# Altium project forwardConverterPCB.PrjPcb (part 1 of 22)
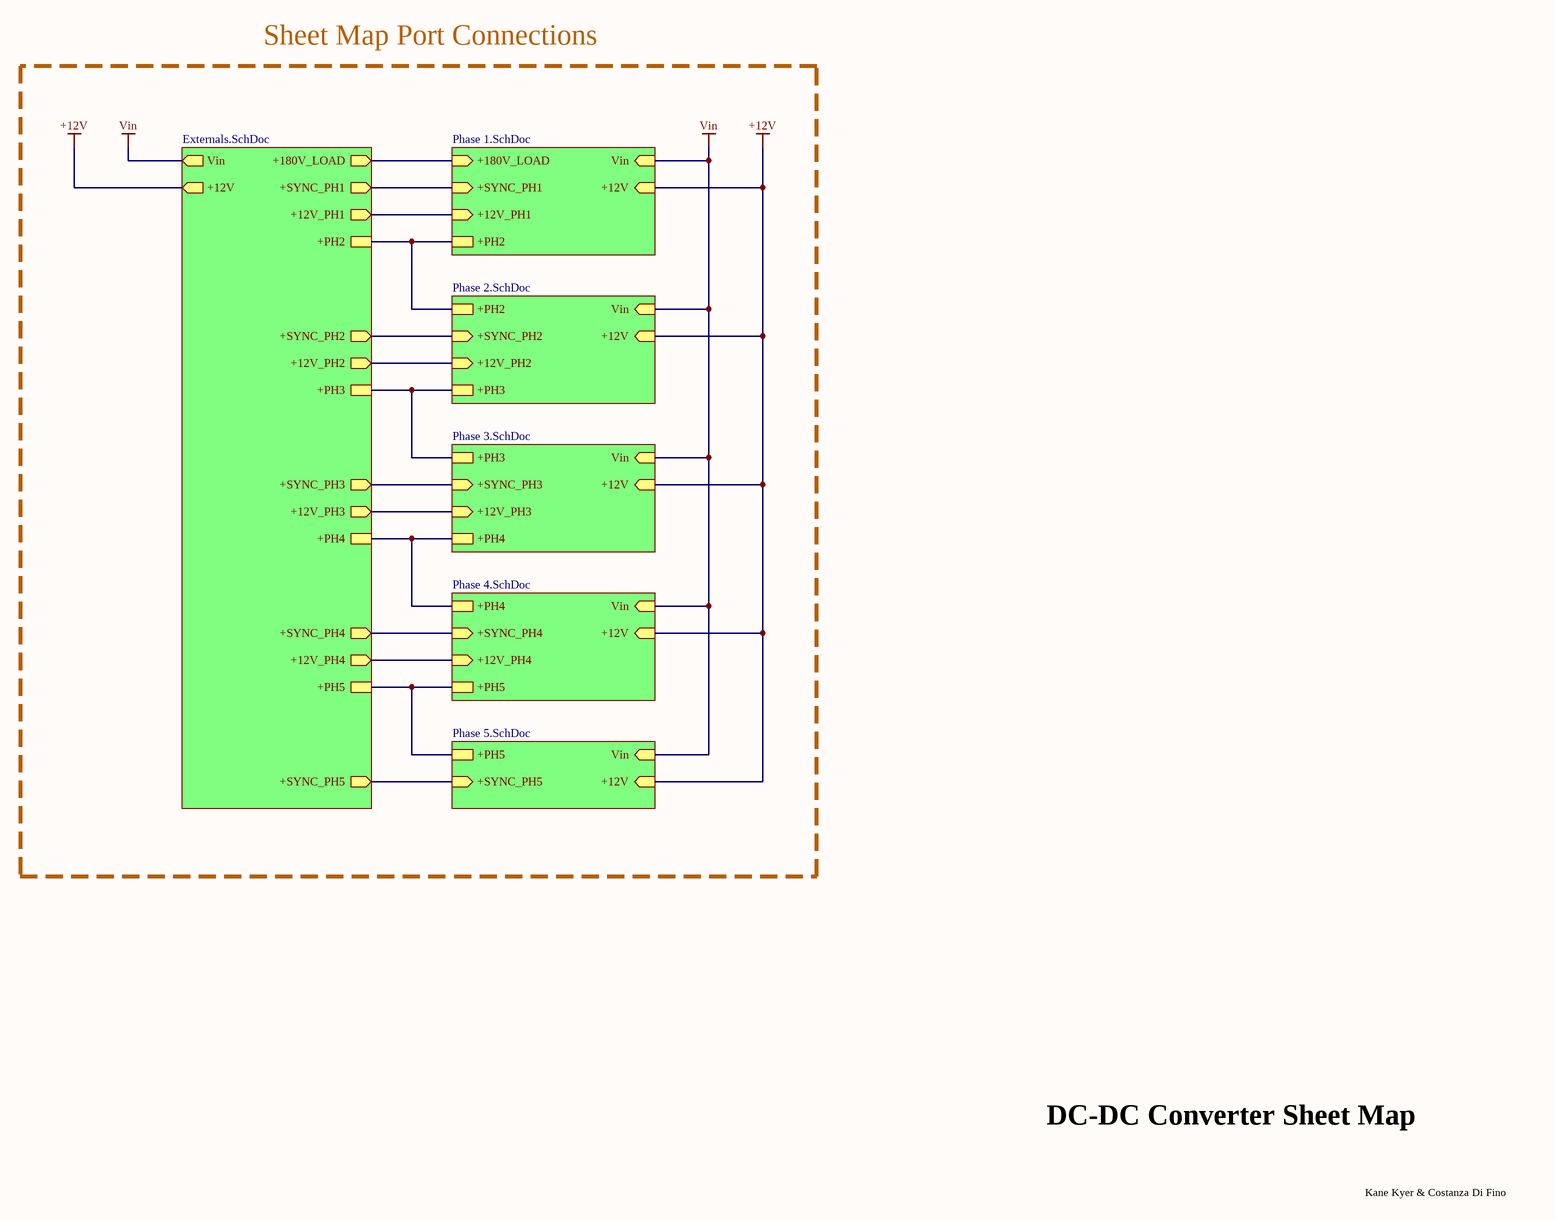
[diagram p0: SHEET_MAP.SchDoc]
7 sheets, 352 parts. Net scope: hierarchical (ports join the sheet entries above them; power ports are global).
Board file: forwardConverterPCB.PcbDoc
Sheets:
  SHEET_MAP.SchDoc
    U_EXTERNAL = Externals.SchDoc
    U_LTC3751_PH1 = Phase 1.SchDoc
    U_LTC3751_PH2 = Phase 2.SchDoc
    U_LTC3751_PH3 = Phase 3.SchDoc
    U_LTC3751_PH4 = Phase 4.SchDoc
    U_LTC3751_PH5 = Phase 5.SchDoc

## Sheet SHEET_MAP.SchDoc
size Tabloid; SheetNumber: 1; SheetTotal: 7

### Sub-sheets
U_EXTERNAL = Externals.SchDoc: +SYNC_PH1 (out), +SYNC_PH2 (out), +SYNC_PH3 (out), +SYNC_PH4 (out), +SYNC_PH5 (out), +180V_LOAD (out), Vin (out), +12V (out), +12V_PH1 (out), +12V_PH2 (out), +12V_PH3 (out), +12V_PH4 (out), +PH2, +PH3, +PH4, +PH5
U_LTC3751_PH1 = Phase 1.SchDoc: +SYNC_PH1 (in), +180V_LOAD (in), Vin (in), +12V (in), +12V_PH1 (in), +PH2
U_LTC3751_PH2 = Phase 2.SchDoc: +SYNC_PH2 (in), Vin (in), +12V (in), +12V_PH2 (in), +PH3, +PH2
U_LTC3751_PH3 = Phase 3.SchDoc: +SYNC_PH3 (in), Vin (in), +12V (in), +12V_PH3 (in), +PH3, +PH4
U_LTC3751_PH4 = Phase 4.SchDoc: +SYNC_PH4 (in), Vin (in), +12V (in), +12V_PH4 (in), +PH4, +PH5
U_LTC3751_PH5 = Phase 5.SchDoc: +SYNC_PH5 (in), Vin (in), +12V (in), +PH5

### Nets
+12V: sheet U_EXTERNAL/+12V, sheet U_LTC3751_PH1/+12V, sheet U_LTC3751_PH2/+12V, sheet U_LTC3751_PH3/+12V, sheet U_LTC3751_PH4/+12V, sheet U_LTC3751_PH5/+12V
Vin: sheet U_EXTERNAL/Vin, sheet U_LTC3751_PH1/Vin, sheet U_LTC3751_PH2/Vin, sheet U_LTC3751_PH3/Vin, sheet U_LTC3751_PH4/Vin, sheet U_LTC3751_PH5/Vin
+PH2: sheet U_EXTERNAL/+PH2, sheet U_LTC3751_PH1/+PH2, sheet U_LTC3751_PH2/+PH2
+PH3: sheet U_EXTERNAL/+PH3, sheet U_LTC3751_PH2/+PH3, sheet U_LTC3751_PH3/+PH3
+PH4: sheet U_EXTERNAL/+PH4, sheet U_LTC3751_PH3/+PH4, sheet U_LTC3751_PH4/+PH4
+PH5: sheet U_EXTERNAL/+PH5, sheet U_LTC3751_PH4/+PH5, sheet U_LTC3751_PH5/+PH5
NetC2_1: sheet U_EXTERNAL/+180V_LOAD, sheet U_LTC3751_PH1/+180V_LOAD
NetC23_2: sheet U_EXTERNAL/+12V_PH1, sheet U_LTC3751_PH1/+12V_PH1
NetC27_2: sheet U_EXTERNAL/+12V_PH3, sheet U_LTC3751_PH3/+12V_PH3
NetC31_2: sheet U_EXTERNAL/+12V_PH2, sheet U_LTC3751_PH2/+12V_PH2
NetC33_2: sheet U_EXTERNAL/+12V_PH4, sheet U_LTC3751_PH4/+12V_PH4
NetT3_1: sheet U_EXTERNAL/+SYNC_PH1, sheet U_LTC3751_PH1/+SYNC_PH1
NetT6_1: sheet U_EXTERNAL/+SYNC_PH2, sheet U_LTC3751_PH2/+SYNC_PH2
NetT9_1: sheet U_EXTERNAL/+SYNC_PH3, sheet U_LTC3751_PH3/+SYNC_PH3
NetT12_1: sheet U_EXTERNAL/+SYNC_PH4, sheet U_LTC3751_PH4/+SYNC_PH4
NetT15_1: sheet U_EXTERNAL/+SYNC_PH5, sheet U_LTC3751_PH5/+SYNC_PH5

### Notes on the sheet
- Sheet Map Port Connections
- DC-DC Converter Sheet Map
- Kane Kyer & Costanza Di Fino

## Sheet Externals.SchDoc
size Tabloid; SheetNumber: 2; SheetTotal: 7
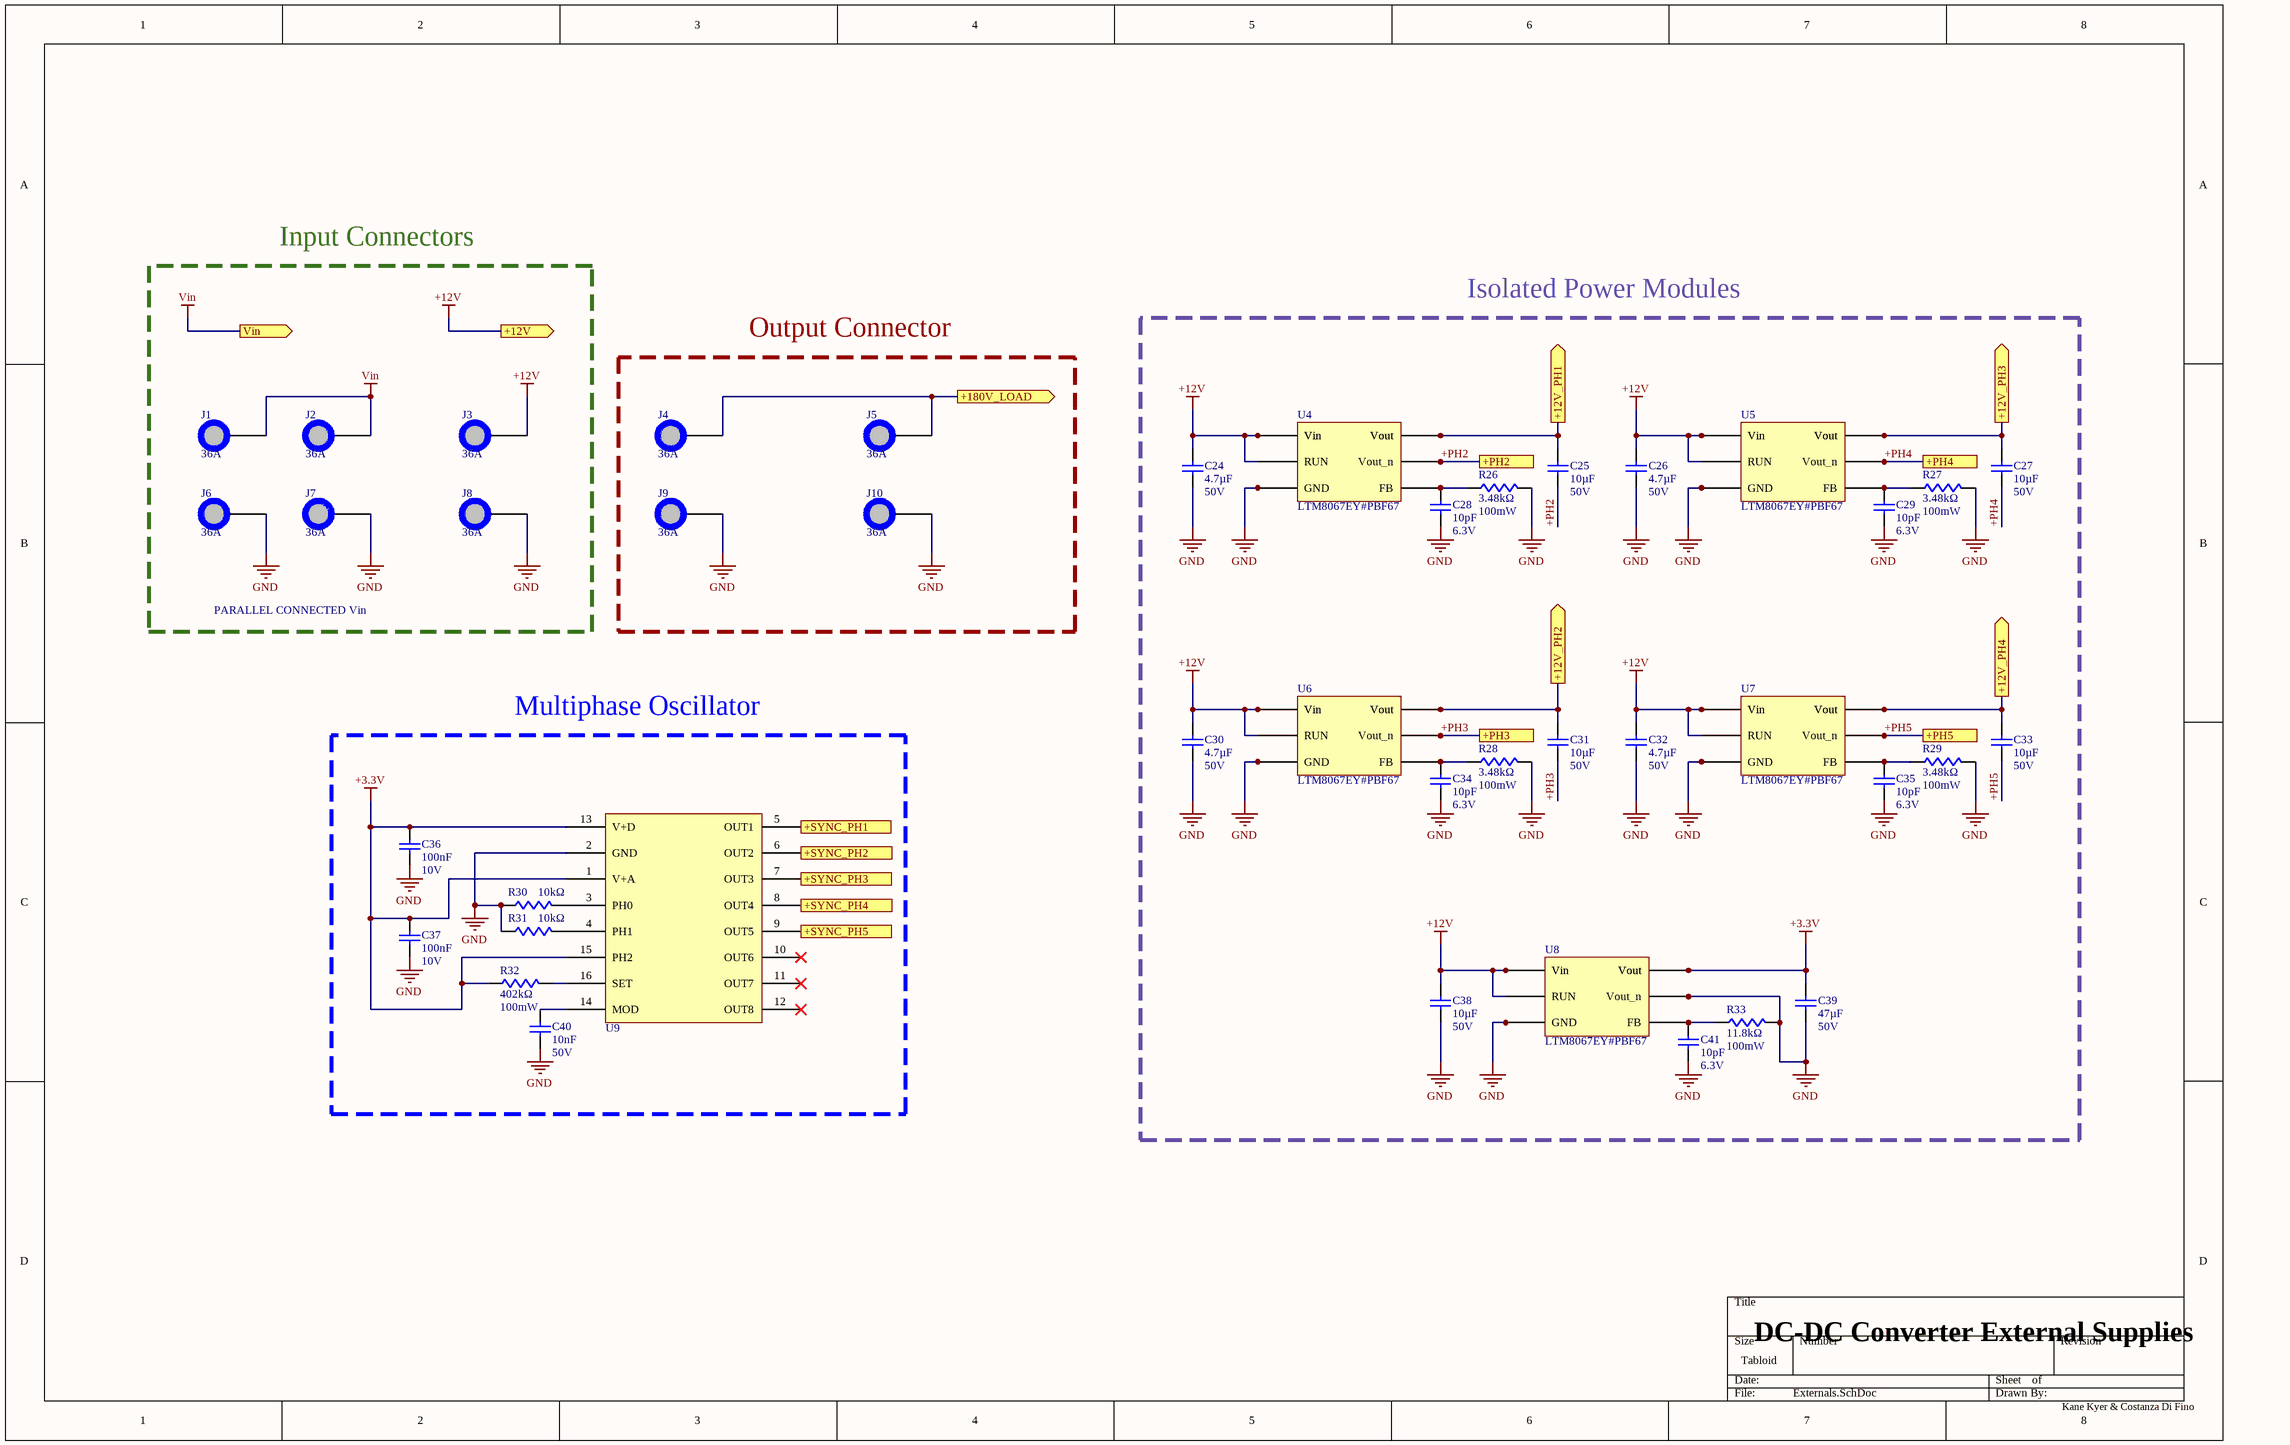
[diagram p1: Externals.SchDoc]

### Parts
C24  value 4.7µF  Voltage Rating (DC): 50V  [C_1206]  (hidden comment: GMC31X7R475K50NT)
C25  value 10µF  Voltage Rating: 50V  [C_1206]  (hidden comment: CL31B106KBHNNNE)
C26  value 4.7µF  Voltage Rating (DC): 50V  [C_1206]  (hidden comment: GMC31X7R475K50NT)
C27  value 10µF  Voltage Rating: 50V  [C_1206]  (hidden comment: CL31B106KBHNNNE)
C28  value 10pF  Voltage Rating: 6.3V  [C_0402]  (hidden comment: 04026A100KAT2A)
C29  value 10pF  Voltage Rating: 6.3V  [C_0402]  (hidden comment: 04026A100KAT2A)
C30  value 4.7µF  Voltage Rating (DC): 50V  [C_1206]  (hidden comment: GMC31X7R475K50NT)
C31  value 10µF  Voltage Rating: 50V  [C_1206]  (hidden comment: CL31B106KBHNNNE)
C32  value 4.7µF  Voltage Rating (DC): 50V  [C_1206]  (hidden comment: GMC31X7R475K50NT)
C33  value 10µF  Voltage Rating: 50V  [C_1206]  (hidden comment: CL31B106KBHNNNE)
C34  value 10pF  Voltage Rating: 6.3V  [C_0402]  (hidden comment: 04026A100KAT2A)
C35  value 10pF  Voltage Rating: 6.3V  [C_0402]  (hidden comment: 04026A100KAT2A)
C36  value 100nF  Voltage Rating (DC): 10V  [C_0402]  (hidden comment: GMC04X7R104K10NT)
C37  value 100nF  Voltage Rating (DC): 10V  [C_0402]  (hidden comment: GMC04X7R104K10NT)
C38  value 10µF  Voltage Rating: 50V  [C_1206]  (hidden comment: CL31B106KBHNNNE)
C39  value 47µF  Voltage Rating (DC): 50V  [C_CKG57N]  (hidden comment: CKG57NX7R1H476M500JJ)
C40  value 10nF  Voltage Rating: 50V  [C_0603]  (hidden comment: C0603C103K5RACTU)
C41  value 10pF  Voltage Rating: 6.3V  [C_0402]  (hidden comment: 04026A100KAT2A)
J1  Current Rating: 36A  [PEM]  (hidden comment: SMTSO-116-8ET)
J2  Current Rating: 36A  [PEM]  (hidden comment: SMTSO-116-8ET)
J3  Current Rating: 36A  [PEM]  (hidden comment: SMTSO-116-8ET)
J4  Current Rating: 36A  [PEM]  (hidden comment: SMTSO-116-8ET)
J5  Current Rating: 36A  [PEM]  (hidden comment: SMTSO-116-8ET)
J6  Current Rating: 36A  [PEM]  (hidden comment: SMTSO-116-8ET)
J7  Current Rating: 36A  [PEM]  (hidden comment: SMTSO-116-8ET)
J8  Current Rating: 36A  [PEM]  (hidden comment: SMTSO-116-8ET)
J9  Current Rating: 36A  [PEM]  (hidden comment: SMTSO-116-8ET)
J10  Current Rating: 36A  [PEM]  (hidden comment: SMTSO-116-8ET)
R26  value 3.48kΩ  Power Dissipation: 100mW  [R_0603]  (hidden comment: RM06F3481CT)
R27  value 3.48kΩ  Power Dissipation: 100mW  [R_0603]  (hidden comment: RM06F3481CT)
R28  value 3.48kΩ  Power Dissipation: 100mW  [R_0603]  (hidden comment: RM06F3481CT)
R29  value 3.48kΩ  Power Dissipation: 100mW  [R_0603]  (hidden comment: RM06F3481CT)
R30  value 10kΩ  [R_0402]  (hidden comment: RM04F1002CT)
R31  value 10kΩ  [R_0402]  (hidden comment: RM04F1002CT)
R32  value 402kΩ  Power Dissipation: 100mW  [R_0603]  (hidden comment: RC0603FR-07402KL)
R33  value 11.8kΩ  Power Dissipation: 100mW  [R_0603]  (hidden comment: RK73H1JTTD1182F)
U4  Manufacturer Part Number: LTM8067EY#PBF67  [LTM8067]  (hidden comment: LTM8067EY#PBF)
U5  Manufacturer Part Number: LTM8067EY#PBF67  [LTM8067]  (hidden comment: LTM8067EY#PBF)
U6  Manufacturer Part Number: LTM8067EY#PBF67  [LTM8067]  (hidden comment: LTM8067EY#PBF)
U7  Manufacturer Part Number: LTM8067EY#PBF67  [LTM8067]  (hidden comment: LTM8067EY#PBF)
U8  Manufacturer Part Number: LTM8067EY#PBF67  [LTM8067]  (hidden comment: LTM8067EY#PBF)
U9  LTC6909HMS#TRPBF  [LTC6909]  (value not drawn)

### Blocks framed on the sheet
Input Connectors: J1-J3 J6-J8
Isolated Power Modules: C24-C35 C38 C39 C41 R26-R29 R33 U4-U8
Output Connector: J4 J5 J9 J10
Multiphase Oscillator: C36 C37 C40 R30-R32 U9

### Ports
+12V (out, see SHEET_MAP[3B], Phase 1[4C], Phase 2[4C], Phase 3[4C], Phase 4[4C], Phase 5[4B]), +12V_PH1 (out, see SHEET_MAP[3B], Phase 1[5C]), +12V_PH2 (out, see SHEET_MAP[3B], Phase 2[5C]), +12V_PH3 (out, see SHEET_MAP[3C], Phase 3[5C]), +12V_PH4 (out, see SHEET_MAP[3C], Phase 4[5C]), +180V_LOAD (out, see SHEET_MAP[3B], Phase 1[6B]), +PH2 (see SHEET_MAP[3B], Phase 1[6C], Phase 2[6B]), +PH3 (see SHEET_MAP[3B], Phase 2[6C], Phase 3[6B]), +PH4 (see SHEET_MAP[3C], Phase 3[6C], Phase 4[6B]), +PH5 (see SHEET_MAP[3C], Phase 4[6C], Phase 5[6B]), +SYNC_PH1 (out, see SHEET_MAP[3B], Phase 1[2D]), +SYNC_PH2 (out, see SHEET_MAP[3B], Phase 2[2D]), +SYNC_PH3 (out, see SHEET_MAP[3C], Phase 3[2D]), +SYNC_PH4 (out, see SHEET_MAP[3C], Phase 4[2D]), +SYNC_PH5 (out, see SHEET_MAP[3C], Phase 5[2D]), Vin (out, see SHEET_MAP[3B], Phase 1[1B], Phase 2[1B], Phase 3[1B], Phase 4[1B], Phase 5[1B])

### Nets
+3.3V: C36.2 C37.2 C39.2 R32.1 U8.A6(Vout) U8.A7(Vout) U8.B6(Vout) U8.B7(Vout) U9.1(V+A) U9.13(V+D) U9.15(PH2)
+12V: C24.2 C26.2 C30.2 C32.2 C38.2 J3.1 U4.F3(RUN) U4.G1(Vin) U4.G2(Vin) U4.H1(Vin) U4.H2(Vin) U5.F3(RUN) U5.G1(Vin) U5.G2(Vin) U5.H1(Vin) U5.H2(Vin) U6.F3(RUN) U6.G1(Vin) U6.G2(Vin) U6.H1(Vin) U6.H2(Vin) U7.F3(RUN) U7.G1(Vin) U7.G2(Vin) U7.H1(Vin) U7.H2(Vin) U8.F3(RUN) U8.G1(Vin) U8.G2(Vin) U8.H1(Vin) U8.H2(Vin) ; port +12V
GND: C24.1 C26.1 C28.2 C29.2 C30.1 C32.1 C34.2 C35.2 C36.1 C37.1 C38.1 C39.1 C40.1 C41.2 J6.1 J7.1 J8.1 J9.1 J10.1 R26.2 R27.2 R28.2 R29.2 R30.1 R31.1 R33.2 U4.E1(GND) U4.E2(GND) U4.E3(GND) U4.E4(GND) U4.E5(GND) U4.E6(GND) U4.E7(GND) U4.F4(GND) U4.F5(GND) U4.F6(GND) U4.F7(GND) U4.G4(GND) U4.G5(GND) U4.G6(GND) U4.H4(GND) U4.H5(GND) U4.H6(GND) U4.H7(GND) U5.E1(GND) U5.E2(GND) U5.E3(GND) U5.E4(GND) U5.E5(GND) U5.E6(GND) U5.E7(GND) U5.F4(GND) U5.F5(GND) U5.F6(GND) U5.F7(GND) U5.G4(GND) U5.G5(GND) U5.G6(GND) U5.H4(GND) U5.H5(GND) U5.H6(GND) U5.H7(GND) U6.E1(GND) U6.E2(GND) U6.E3(GND) U6.E4(GND) U6.E5(GND) U6.E6(GND) U6.E7(GND) U6.F4(GND) U6.F5(GND) U6.F6(GND) U6.F7(GND) U6.G4(GND) U6.G5(GND) U6.G6(GND) U6.H4(GND) U6.H5(GND) U6.H6(GND) U6.H7(GND) U7.E1(GND) U7.E2(GND) U7.E3(GND) U7.E4(GND) U7.E5(GND) U7.E6(GND) U7.E7(GND) U7.F4(GND) U7.F5(GND) U7.F6(GND) U7.F7(GND) U7.G4(GND) U7.G5(GND) U7.G6(GND) U7.H4(GND) U7.H5(GND) U7.H6(GND) U7.H7(GND) U8.A1(Vout_n) U8.A2(Vout_n) U8.A3(Vout_n) U8.A4(Vout_n) U8.A5(Vout_n) U8.B1(Vout_n) U8.B2(Vout_n) U8.B3(Vout_n) U8.B4(Vout_n) U8.B5(Vout_n) U8.E1(GND) U8.E2(GND) U8.E3(GND) U8.E4(GND) U8.E5(GND) U8.E6(GND) U8.E7(GND) U8.F4(GND) U8.F5(GND) U8.F6(GND) U8.F7(GND) U8.G4(GND) U8.G5(GND) U8.G6(GND) U8.H4(GND) U8.H5(GND) U8.H6(GND) U8.H7(GND) U9.2(GND)
Vin: J1.1 J2.1 ; port Vin
+PH2: C25.1 U4.A1(Vout_n) U4.A2(Vout_n) U4.A3(Vout_n) U4.A4(Vout_n) U4.A5(Vout_n) U4.B1(Vout_n) U4.B2(Vout_n) U4.B3(Vout_n) U4.B4(Vout_n) U4.B5(Vout_n) ; port +PH2
+PH3: C31.1 U6.A1(Vout_n) U6.A2(Vout_n) U6.A3(Vout_n) U6.A4(Vout_n) U6.A5(Vout_n) U6.B1(Vout_n) U6.B2(Vout_n) U6.B3(Vout_n) U6.B4(Vout_n) U6.B5(Vout_n) ; port +PH3
+PH4: C27.1 U5.A1(Vout_n) U5.A2(Vout_n) U5.A3(Vout_n) U5.A4(Vout_n) U5.A5(Vout_n) U5.B1(Vout_n) U5.B2(Vout_n) U5.B3(Vout_n) U5.B4(Vout_n) U5.B5(Vout_n) ; port +PH4
+PH5: C33.1 U7.A1(Vout_n) U7.A2(Vout_n) U7.A3(Vout_n) U7.A4(Vout_n) U7.A5(Vout_n) U7.B1(Vout_n) U7.B2(Vout_n) U7.B3(Vout_n) U7.B4(Vout_n) U7.B5(Vout_n) ; port +PH5
NetC2_1: J4.1 J5.1 ; port +180V_LOAD
NetC23_2: C25.2 U4.A6(Vout) U4.A7(Vout) U4.B6(Vout) U4.B7(Vout) ; port +12V_PH1
NetC27_2: C27.2 U5.A6(Vout) U5.A7(Vout) U5.B6(Vout) U5.B7(Vout) ; port +12V_PH3
NetC28_1: C28.1 R26.1 U4.G7(FB)
NetC29_1: C29.1 R27.1 U5.G7(FB)
NetC31_2: C31.2 U6.A6(Vout) U6.A7(Vout) U6.B6(Vout) U6.B7(Vout) ; port +12V_PH2
NetC33_2: C33.2 U7.A6(Vout) U7.A7(Vout) U7.B6(Vout) U7.B7(Vout) ; port +12V_PH4
NetC34_1: C34.1 R28.1 U6.G7(FB)
NetC35_1: C35.1 R29.1 U7.G7(FB)
NetC40_2: C40.2 U9.14(MOD)
NetC41_1: C41.1 R33.1 U8.G7(FB)
NetR30_2: R30.2 U9.3(PH0)
NetR31_2: R31.2 U9.4(PH1)
NetR32_2: R32.2 U9.16(SET)
NetT3_1: U9.5(OUT1) ; port +SYNC_PH1
NetT6_1: U9.6(OUT2) ; port +SYNC_PH2
NetT9_1: U9.7(OUT3) ; port +SYNC_PH3
NetT12_1: U9.8(OUT4) ; port +SYNC_PH4
NetT15_1: U9.9(OUT5) ; port +SYNC_PH5

Not connected (* = marked no-connect by the designer): U9 10(OUT6)* 11(OUT7)* 12(OUT8)*

### Notes on the sheet
- PARALLEL CONNECTED Vin
- DC-DC Converter External Supplies
- Kane Kyer & Costanza Di Fino